# Altium schematic sheet rx.SchDoc
size 508 x 210 mm
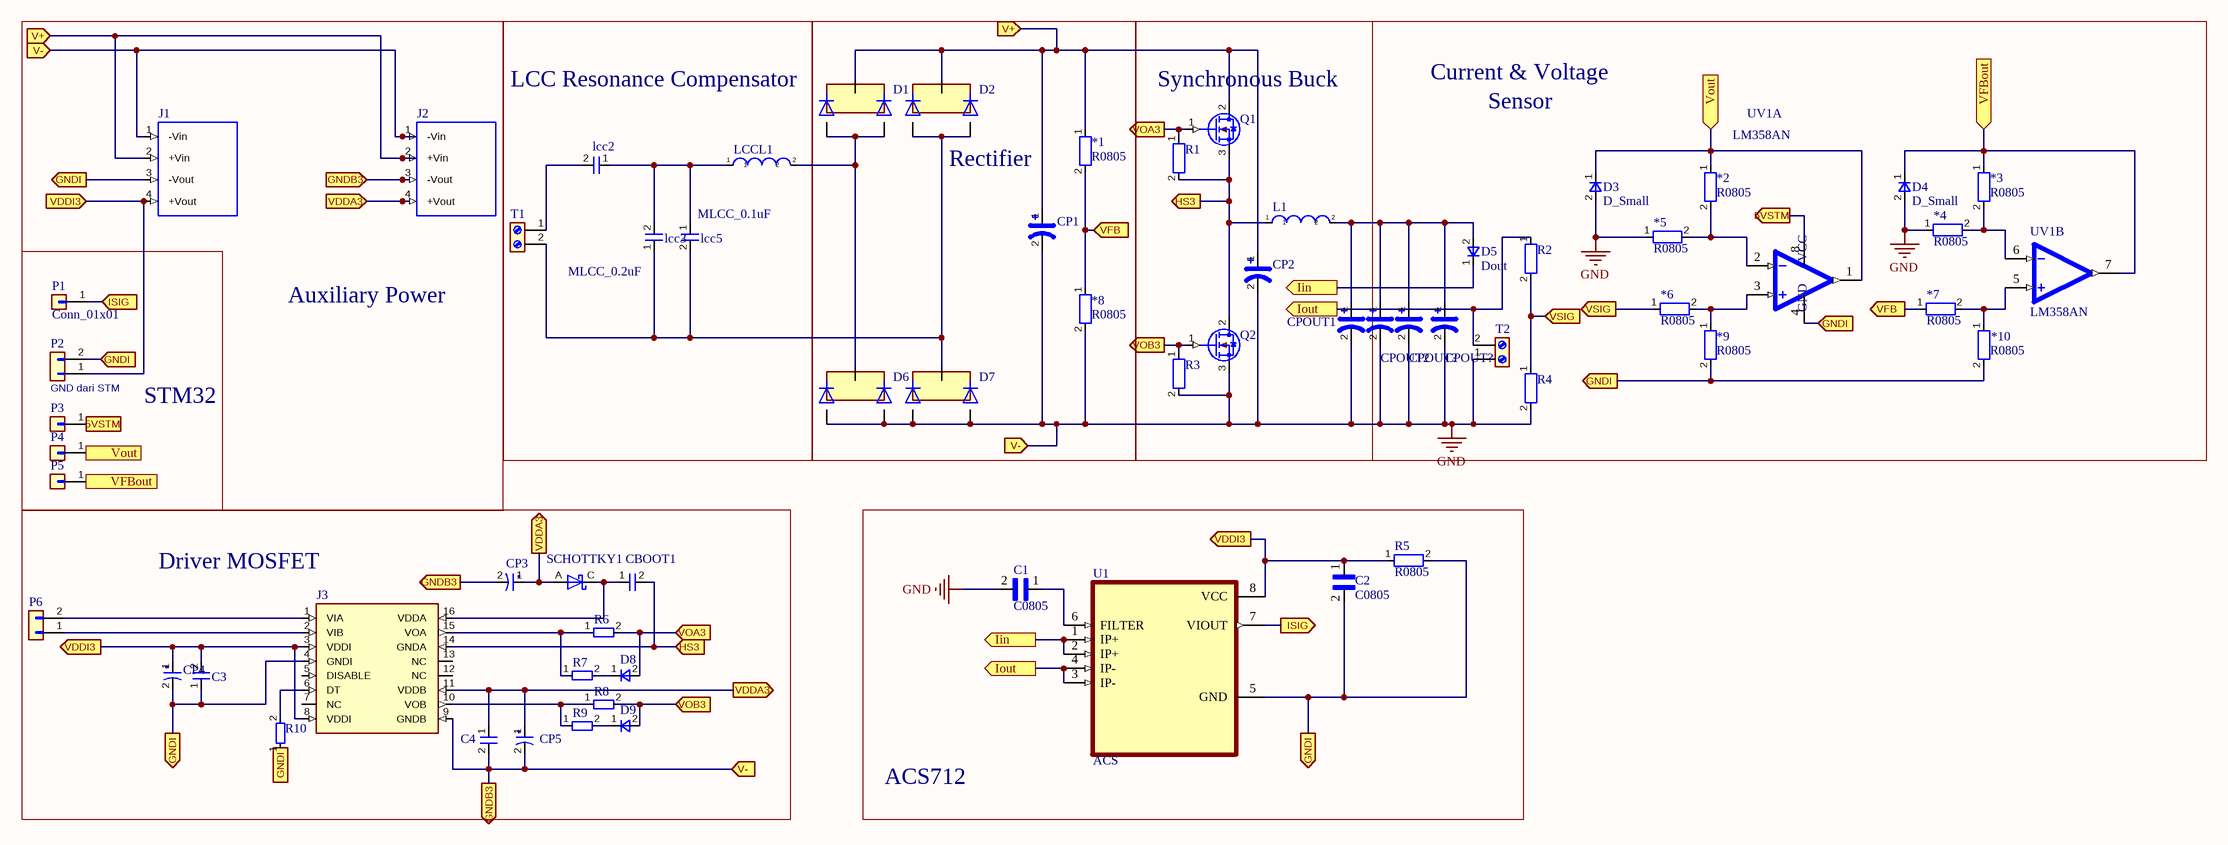
[diagram p0: rx.SchDoc]

## Parts
(Parts that share a designator on the sheet are numbered #1, #2 ... from top to bottom, then left to right.)
*1  R0805  [1206]
*2  R0805  [1206]
*3  R0805  [1206]
*4  R0805  [1206]
*5  R0805  [1206]
*6  R0805  [1206]
*7  R0805  [1206]
*8  R0805  [1206]
*9  R0805  [1206]
*10  R0805  [1206]
C1  C0805  [0805]
C2  C0805  [0805]
C3  C_Small  [1206]  (value not drawn)
C4  C_Small  [1206]  (value not drawn)
CBOOT1  C_Small  [1206]  (value not drawn)
CP1  C  [CPD10]  (value not drawn)
CP2  C  [CPD10]  (value not drawn)
CP3  CP1_Small  [CP_Radial_D5.0mm_P2.50mm]  (value not drawn)
CP4  CP1_Small  [CP_Radial_D5.0mm_P2.50mm]  (value not drawn)
CP5  CP1_Small  [CP_Radial_D5.0mm_P2.50mm]  (value not drawn)
CPOUT1  CPout  [CPD10]  (value not drawn)
CPOUT2  CPout  [CPD10]  (value not drawn)
CPOUT?#1  CPout  [CPD10]  (value not drawn)
CPOUT?#2  CPout  [CPD10]  (value not drawn)
D1  Soki-bridge  [TO-220]  (value not drawn)
D2  Soki-bridge  [TO-220]  (value not drawn)
D3  D_Small  [DIO_LL4148]
D4  D_Small  [DIO_LL4148]
D5  Dout  [ss54]
D6  Soki-bridge  [TO-220]  (value not drawn)
D7  Soki-bridge  [TO-220]  (value not drawn)
D8  D_Small  [DIO_LL4148]  (value not drawn)
D9  D_Small  [DIO_LL4148]  (value not drawn)
J1  B1205S_DCDC  [DCDC5V]  (value not drawn)
J2  B1212S_DCDC  [DCDC5V]  (value not drawn)
J3  Si8233  [Si8233]  (value not drawn)
L1  INDUCTOR  [Inductor]  (value not drawn)
lcc2  MLCC_0.01uF  [MLCC1825_0.01uF]  (value not drawn)
lcc3  MLCC_0.2uF  [MLCC2220_0.2uF]
lcc5  MLCC_0.1uF  [MLCC1206_0.1uF]
LCCL1  INDUCTOR  [Inductor]  (value not drawn)
P1  Conn_01x01  [PinHeader_1x01_P2.54mm_Vertical]
P2  Conn_01x02  [PinHeader_1x02_P2.54mm_Vertical]  (value not drawn)
P3  Conn_01x01  [PinHeader_1x01_P2.54mm_Vertical]  (value not drawn)
P4  Conn_01x01  [PinHeader_1x01_P2.54mm_Vertical]  (value not drawn)
P5  Conn_01x01  [PinHeader_1x01_P2.54mm_Vertical]  (value not drawn)
P6  Conn_01x02  [PinHeader_1x02_P2.54mm_Vertical]  (value not drawn)
Q1  Q_NMOS_DSG  [MOSFET]  (value not drawn)
Q2  Q_NMOS_DSG  [MOSFET]  (value not drawn)
R1  R  [1206]  (value not drawn)
R2  R  [1206]  (value not drawn)
R3  R  [1206]  (value not drawn)
R4  R  [1206]  (value not drawn)
R5  R0805  [1206]
R6  R_Small  [1206]  (value not drawn)
R7  R_Small  [1206]  (value not drawn)
R8  R_Small  [1206]  (value not drawn)
R9  R_Small  [1206]  (value not drawn)
R10  R_Small  [1206]  (value not drawn)
SCHOTTKY1  Schottky  [Schottky]  (value not drawn)
T1  Screw_Terminal_01x02  [Terminal]  (value not drawn)
T2  Screw_Terminal_01x02  [Terminal]  (value not drawn)
U1  ACS  [SOIC127P600X175-8N]
UV1  LM358AN  [Dip8]  (parts A,B of 2)

## Blocks framed on the sheet
Auxiliary Power: J1 J2
LCC Resonance Compensator: lcc2 lcc3 lcc5 LCCL1 T1
Rectifier: *1 *8 CP1 D1 D2 D6 D7
Synchronous Buck: CP2 CPOUT1 L1 Q1 Q2 R1 R3
STM32: P1-P5
Driver MOSFET: C3 C4 CBOOT1 CP3-CP5 D8 D9 J3 P6 R6-R10 SCHOTTKY1
ACS712: C1 C2 R5 U1

## Ports
5VSTM (in), 5VSTM (out), GNDB3 (in), GNDB3 (out), GNDI (in), GNDI (out), HS3 (in), HS3 (out), Iin (out), Iout (out), ISIG (in), ISIG (out), V+ (in), V- (in), VDDA3 (in), VDDA3 (out), VDDI3 (in), VDDI3 (out), VFB (in), VFB (out), VFBout (in), VOA3 (in), VOA3 (out), VOB3 (in), VOB3 (out), Vout (in), Vout (out), VSIG (in), VSIG (out)

## Nets
GND: *4.1 *5.1 *8.2 C1.2 C4.2 CP1.2 CP2.2 CP3.2 CP5.2 CPOUT1.2 CPOUT2.2 CPOUT?#1.2 CPOUT?#2.2 D3.2(A) D4.2(A) D6.1(A1) D6.3(A2) D7.1(A1) D7.3(A2) J1.1(-Vin) J2.1(-Vin) J2.3(-Vout) J3.9(GNDB) Q2.3(S) R3.2 R4.2 T2.1(Pin_1) ; port V-, port GNDB3
5VSTM: P3.1(Pin_1) UV1.8(VCC) ; port 5VSTM
GNDI: *9.2 *10.2 C2.2 C3.1 CP4.2 J1.3(-Vout) J3.4(GNDI) P2.2(Pin_2) R5.2 R10.1 U1.5(GND) UV1.4(VEE/GND) ; port GNDI
HS3: CBOOT1.2 J3.14(GNDA) L1.1 Q1.3(S) Q2.2(D) R1.2 ; port HS3
Iin: D5.1(K) U1.1(IP+) U1.2(IP+) ; port Iin
Iout: R2.1 T2.2(Pin_2) U1.3(IP-) U1.4(IP-) ; port Iout
ISIG: P1.1(Pin_1) U1.7(VIOUT) ; port ISIG
V+: *1.1 CP1.1 CP2.1 D1.2(C) D2.2(C) J1.2(+Vin) J2.2(+Vin) Q1.2(D) ; port V+
VDDA3: C4.1 CP3.1 CP5.1 J2.4(+Vout) J3.11(VDDB) SCHOTTKY1.A ; port VDDA3
VDDI3: C2.1 C3.2 CP4.1 J1.4(+Vout) J3.3(VDDI) J3.8(VDDI) P2.1(Pin_1) R5.1 U1.8(VCC) ; port VDDI3
VFB: *1.2 *7.1 *8.1 ; port VFB
VFBout: *3.1 D4.1(K) P5.1(Pin_1) UV1.7(OUTB) ; port VFBout
VOA3: D8.2(A) Q1.1(G) R1.1 R6.2 ; port VOA3
VOB3: D9.2(A) Q2.1(G) R3.1 R8.2 ; port VOB3
Vout: *2.1 D3.1(K) P4.1(Pin_1) UV1.1(OUTA) ; port Vout
VSIG: *6.1 R2.2 R4.1 ; port VSIG
Net*2_2: *2.2 *5.2 UV1.2(-INA)
Net*3_2: *3.2 *4.2 UV1.6(-INB)
Net*6_2: *6.2 *9.1 UV1.3(+INA)
Net*7_2: *7.2 *10.1 UV1.5(+INB)
NetC1_1: C1.1 U1.6(FILTER)
NetCBOOT1_1: CBOOT1.1 J3.16(VDDA) SCHOTTKY1.C(K)
NetCPOUT1_1: CPOUT1.1 CPOUT2.1 CPOUT?#1.1 CPOUT?#2.1 D5.2(A) L1.2
NetD1_1: D1.1(A1) D1.3(A2) D6.2(C) LCCL1.2
NetD2_1: D2.1(A1) D2.3(A2) D7.2(C) lcc3.1 lcc5.2 T1.2(Pin_2)
NetD8_1: D8.1(K) R7.2
NetD9_1: D9.1(K) R9.2
NetJ3_1: J3.1(VIA) P6.2(Pin_2)
NetJ3_2: J3.2(VIB) P6.1(Pin_1)
NetJ3_6: J3.6(DT) R10.2
NetJ3_10: J3.10(VOB) R8.1 R9.1
NetJ3_15: J3.15(VOA) R6.1 R7.1
Netlcc2_1: lcc2.1 lcc3.2 lcc5.1 LCCL1.1
Netlcc2_2: lcc2.2 T1.1(Pin_1)

Not connected (* = marked no-connect by the designer): J3 5(DISABLE) 7(NC) 12(NC) 13(NC)

## Notes on the sheet
- Current & Voltage
- Sensor
- (near P2) GND dari STM
- 1
- 2
- 3
- 4
- 5
- 6
- A
- B
- C
- D
- Title:
- File: rx.sch
- Sheet: /
- KiCad E.D.A.  kicad (5.1.4)-1
- Size: A4
- Date:
- Rev:
- Id: 1/1
- (in symbol LM358AN, part A) GND

## Library data of the parts
C1 C2 = C0805: Cap Ceramic 150pF 100V C0G 5% Pad SMD 0805 125Â°C Automotive T/R; MP: GCM2165C2A151JA16D; Package: None; Price: None; Value: *; Availability: Unavailable
CP1 CP2 = CP1
D1 D2 D6 D7 = Soki-bridge: 10A, 35V, Schottky Rectifier; MF: Taiwan Semiconductor; MP: MBR1035CT; SnapEDA_Link: https://www.snapeda.com/parts/MBR1035CT/Taiwan+Semiconductor/view-part/?ref=snap; Package: TO-220AB-3 Taiwan Semiconductor; Value: *; Check_prices: https://www.snapeda.com/parts/MBR1035CT/Taiwan+Semiconductor/view-part/?ref=eda
U1 = ACS: Current Sensor 5A 1 Channel Hall Effect, Open Loop Bidirectional 8-SOIC (0.154, 3.90mm Width); MF: Allegro; MP: ACS712ELCTR-05B-T; SnapEDA_Link: https://www.snapeda.com/parts/ACS712ELCTR-05B-T/Allegro%20Industries/view-part/330078/?ref=snap; Availability: In Stock; Check_prices: https://www.snapeda.com/parts/ACS712ELCTR-05B-T/Allegro%20Industries/view-part/330078/?ref=eda; Value: *; Package: SOIC-8 Allegro MicroSystems LLC; Price: None
UV1 = LM358AN: General Purpose Amplifier 2 Circuit - 8-Mini DIP; MF: STMicroelectronics; SnapEDA_Link: https://www.snapeda.com/parts/LM358AN/STMicroelectronics/view-part/?ref=snap; Package: DIP-8 STMicroelectronics; Value: *; MP: LM358AN; Check_prices: https://www.snapeda.com/parts/LM358AN/STMicroelectronics/view-part/?ref=eda